# Altium schematic sheet LED-driver 46W 350mA on UCC28810 ver2.SchDoc
size 420 x 297 mm; CompanyName: "LaV"; DrawnBy: Лазарев В.П.; SheetTotal: 1; PageSetup: Record=PageOptions|CenterHorizontal=True|CenterVertical=True|PrintScale=0.65|XCorrection=1.00|YCorrection=1.00|PrintKind=0|BorderSize=5000000|LeftOffset=0|BottomOffset=0|Orientation=2|PaperLength=1000|PaperWidth=1000|Scale=100|PaperSource=260|PrintQuality=600|MediaType=1|DitherType=10|PaperKind=Letter|PrintScaleMode=1
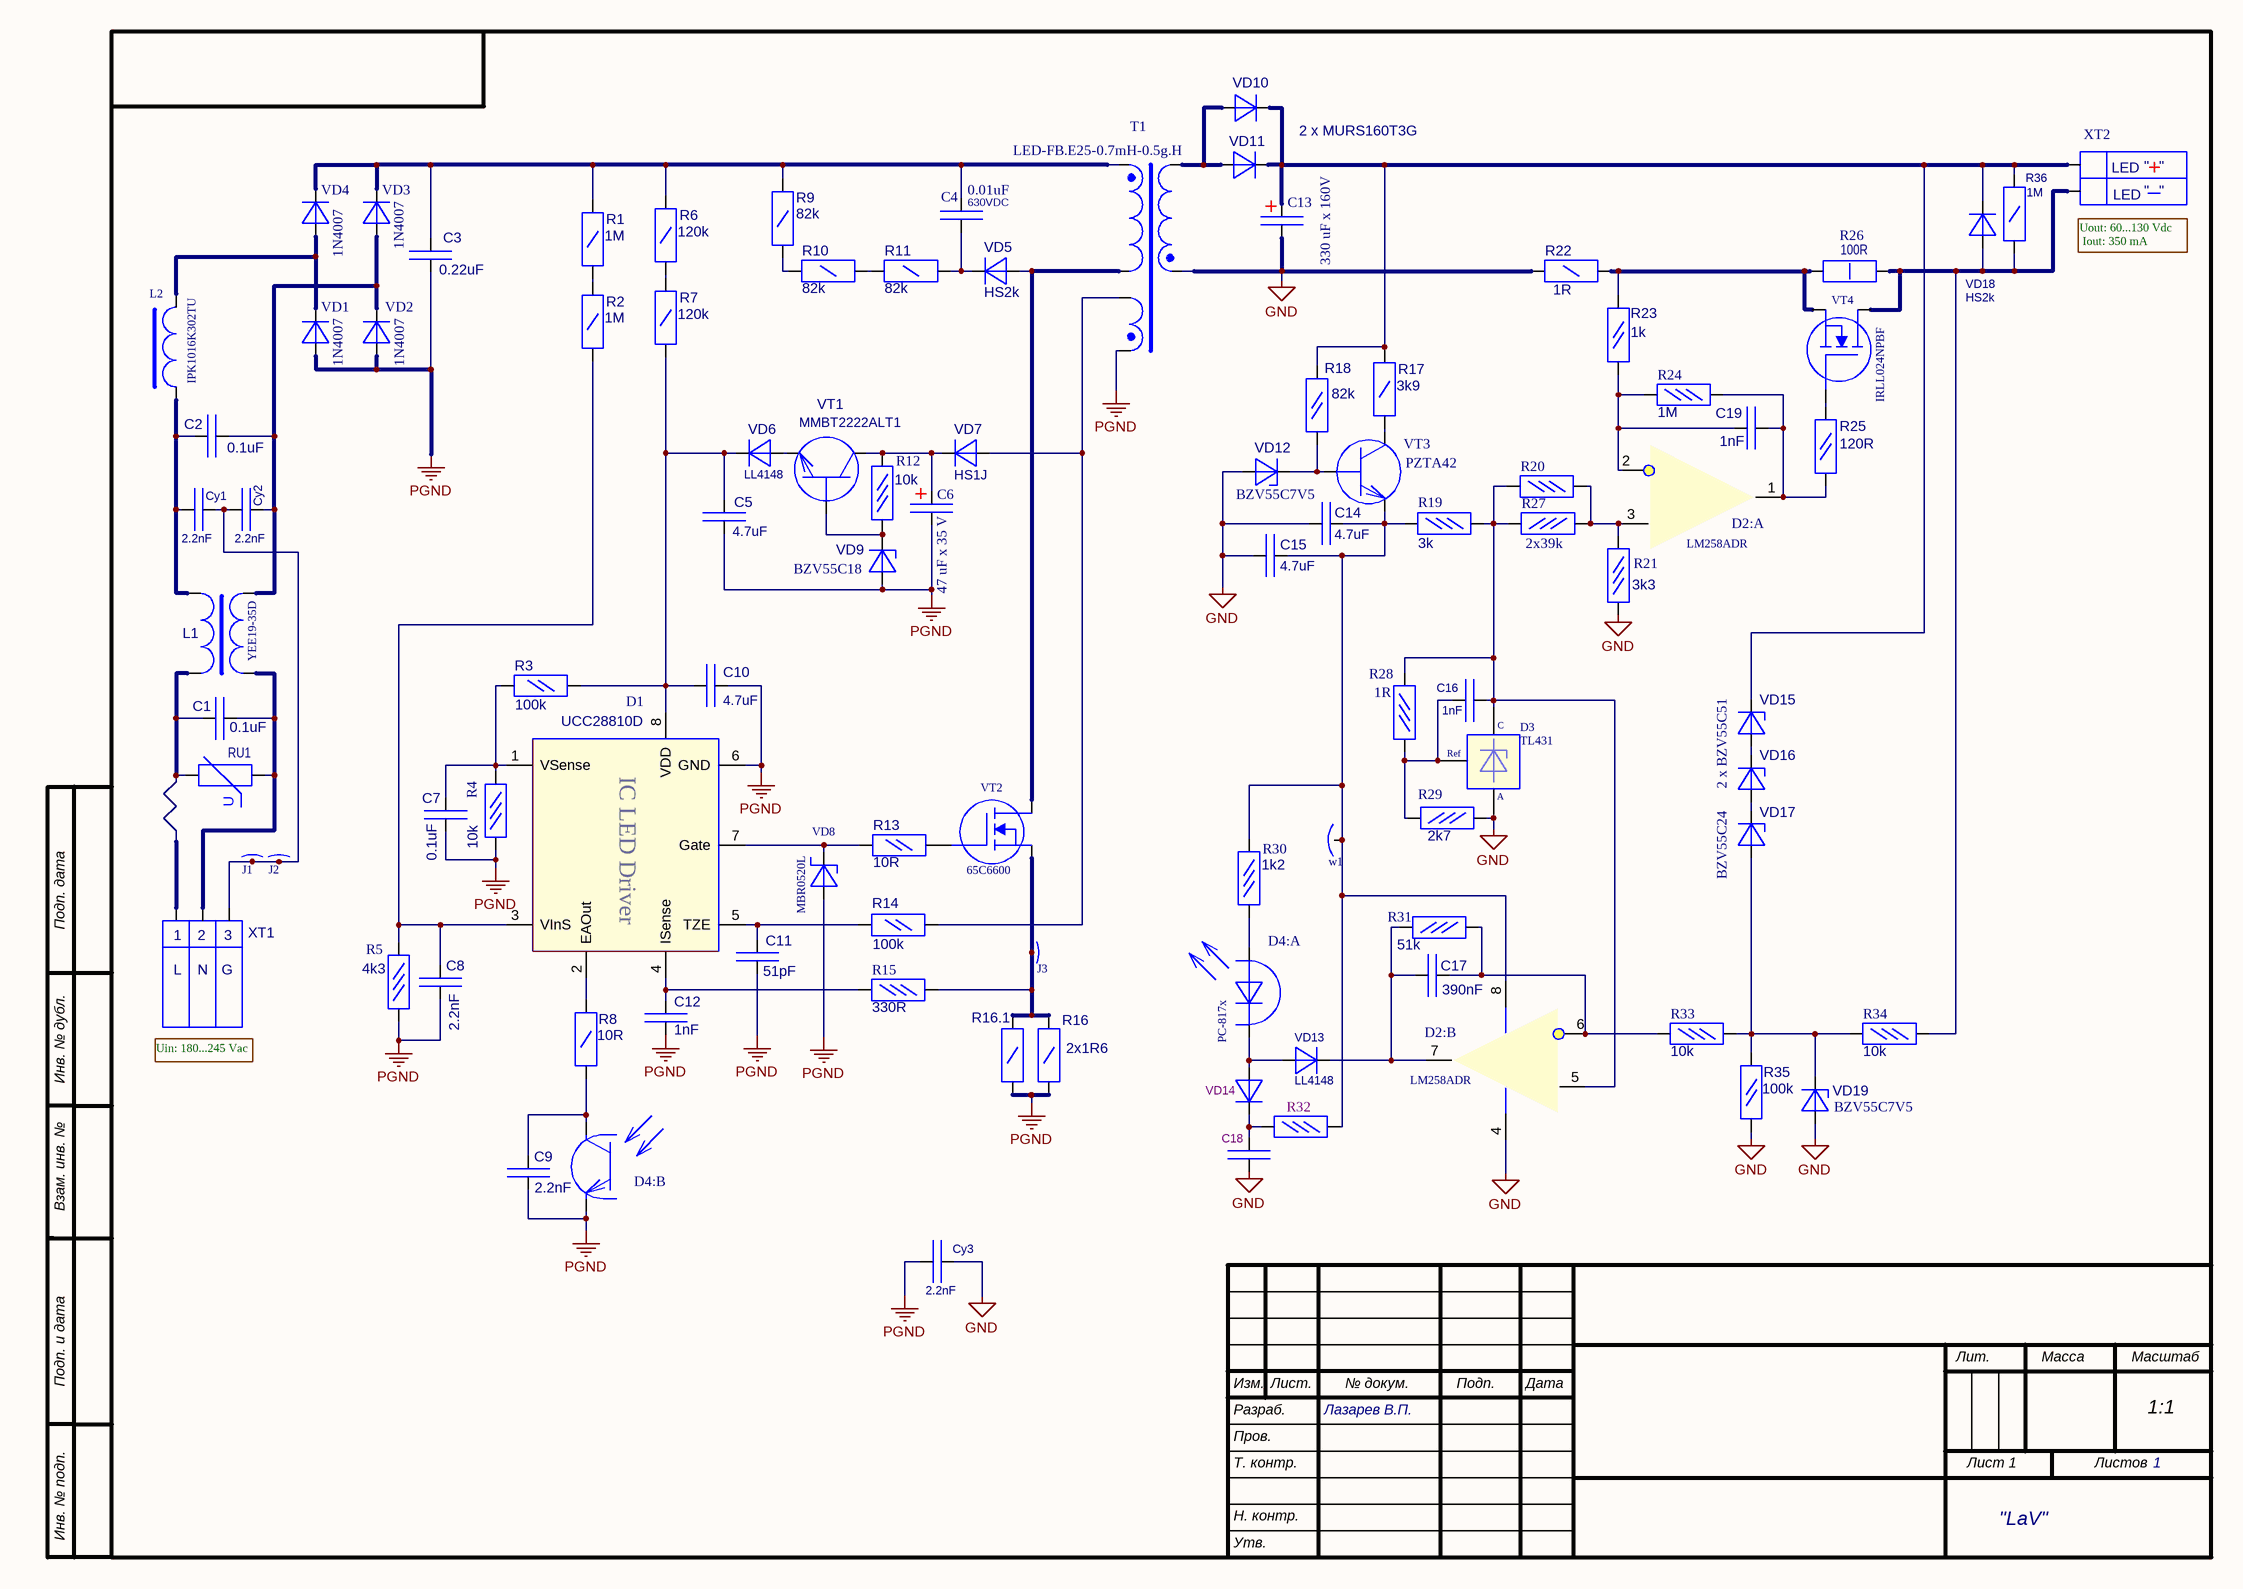
[diagram p0: LED-driver 46W 350mA on UCC28810 ver2.SchDoc]

## Parts
C1  value 0.1uF  [CAPR9.0x18.0-15.0]  (hidden comment: Cap_MKP)
C2  value 0.1uF  [CAPR9.0x18.0-15.0]  (hidden comment: Cap_MKP)
C3  value 0.22uF  [CAPR7.0x18.0-15.0(Polyprop)]  (hidden comment: Cap_MKP)
C4  value 0.01uF  Voltage: 630VDC  [CAPC1812]  (hidden comment: Comment)
C5  value 4.7uF  [CAPC2012 (0805)]  (hidden comment: Cap_SMD)
C6  value 47 uF x 35 V  [CAPR E 6.5x12, pitch 2.5]  (hidden comment: Comment)
C7  value 0.1uF  [1608[0603]]  (hidden comment: Cap_SMD)
C8  value 2.2nF  [1608[0603]]  (hidden comment: Cap_SMD)
C9  value 2.2nF  [1608[0603]]  (hidden comment: Cap_SMD)
C10  value 4.7uF  [CAPC2012 (0805)]  (hidden comment: Cap_SMD)
C11  value 51pF  [1608[0603]]  (hidden comment: Cap_SMD)
C12  value 1nF  [CAPC2012 (0805)]  (hidden comment: Cap_SMD)
C13  value 330 uF x 160V  [CAPR E 10x12.5 pitch 5 - hor]  (hidden comment: Cap Pol)
C14  value 4.7uF  [CAPC2012 (0805)]  (hidden comment: Cap_SMD)
C15  value 4.7uF  [CAPC2012 (0805)]  (hidden comment: Cap_SMD)
C16  value 1nF  [1608[0603]]  (hidden comment: Cap_SMD)
C17  value 390nF  [1608[0603]]  (hidden comment: Cap_SMD)
C18  Cap_SMD  [CAPC2012 (0805)]  (value not drawn)
C19  value 1nF  [1608[0603]]  (hidden comment: Cap_SMD)
Cy1  value 2.2nF  [CAPR Y - 7.5]  (hidden comment: Cap (Y))
Cy2  value 2.2nF  [CAPR Y - 7.5]  (hidden comment: Cap (Y))
Cy3  value 2.2nF  [CAPR Y - 7.5]  (hidden comment: Cap (Y))
D1  UCC28810D  [SO8_M]
D2:  LM258ADR  [SO8_M]  (parts A,B of 2)
D3  TL431  [SOT-23_3D]
D4:  value PC-817x  [PC-817xx]  (hidden comment: Optocoupler)  (parts A,B of 2)
J1  Jumper_1  [AXIAL- Jumper_9.5mm]  (value not drawn)  (net tie)
J2  Jumper_1  [AXIAL- Jumper_9.5mm]  (value not drawn)  (net tie)
J3  Jumper_1  [AXIAL- Jumper_15.0mm]  (value not drawn)  (net tie)
L1  value YEE19-35D  [YEE19-353D]  (hidden comment: Trans EMI)
L2  PartNumber: IPK1016K302TU  [Choke Barbell]  (hidden comment: 3 mH)
R1  value 1M  [RESC3216(1206)N]  (hidden comment: Res 1/4W)
R2  value 1M  [RESC3216(1206)N]  (hidden comment: Res 1/4W)
R3  value 100k  [RESC2012(0805)]  (hidden comment: Res 1/8W)
R4  value 10k  [RESC1608(0603)]  (hidden comment: Res 1/16W)
R5  value 4k3  [RESC1608(0603)]  (hidden comment: Res 1/16W)
R6  value 120k  [RESC3216(1206)N]  (hidden comment: Res 1/4W)
R7  value 120k  [RESC3216(1206)N]  (hidden comment: Res 1/4W)
R8  value 10R  [RESC3216(1206)N]  (hidden comment: Res 1/4W)
R9  value 82k  [RESC3216(1206)N]  (hidden comment: Res 1/4W)
R10  value 82k  [RESC3216(1206)N]  (hidden comment: Res 1/4W)
R11  value 82k  [RESC3216(1206)N]  (hidden comment: Res 1/4W)
R12  value 10k  [RESC1608(0603)]  (hidden comment: Res 1/16W)
R13  value 10R  [RESC2012(0805)]  (hidden comment: Res 1/8W)
R14  value 100k  [RESC2012(0805)]  (hidden comment: Res 1/8W)
R15  value 330R  [RESC1608(0603)]  (hidden comment: Res 1/16W)
R16  value 2x1R6  [RESC3216(1206)N]  (hidden comment: Res 1/4W)
R16.1  Res 1/4W  [RESC3216(1206)N]  (value not drawn)
R17  value 3k9  [RESC3216(1206)N]  (hidden comment: Res 1/4W)
R18  value 82k  [RESC2012(0805)]  (hidden comment: Res 1/8W)
R19  value 3k  [RESC1608(0603)]  (hidden comment: Res 1/16W)
R20  Res 1/16W  [RESC1608(0603)]  (value not drawn)
R21  value 3k3  [RESC1608(0603)]  (hidden comment: Res 1/16W)
R22  value 1R  [RESC3216(1206)N]  (hidden comment: Res 1/4W)
R23  value 1k  [RESC2012(0805)]  (hidden comment: Res 1/8W)
R24  value 1M  [RESC1608(0603)]  (hidden comment: Res 1/16W)
R25  value 120R  [RESC2012(0805)]  (hidden comment: Res 1/8W)
R26  value 100R  [RESC6332]  (hidden comment: Res 1W)
R27  value 2x39k  [RESC1608(0603)]  (hidden comment: Res 1/16W)
R28  value 1R  [RESC1608(0603)]  (hidden comment: Res 1/16W)
R29  value 2k7  [RESC1608(0603)]  (hidden comment: Res 1/16W)
R30  value 1k2  [RESC1608(0603)]  (hidden comment: Res 1/16W)
R31  value 51k  [RESC1608(0603)]  (hidden comment: Res 1/16W)
R32  Res 1/16W  [RESC1608(0603)]  (value not drawn)
R33  value 10k  [RESC1608(0603)]  (hidden comment: Res 1/16W)
R34  value 10k  [RESC1608(0603)]  (hidden comment: Res 1/16W)
R35  value 100k  [RESC2012(0805)]  (hidden comment: Res 1/8W)
R36  value 1M  [RESC3216(1206)N]  (hidden comment: Res 1/4W)
RU1  Varistor  [VAristor 7.5-11x5]  (value not drawn)
T1  LED-FB.E25-0.7mH-0.5g.H  [FB-E25/50W]
VD1  value 1N4007  [CD4532-1812 (mod)]
VD2  value 1N4007  [CD4532-1812 (mod)]
VD3  value 1N4007  [CD4532-1812 (mod)]  (hidden comment: Diode HS1x)
VD4  value 1N4007  [CD4532-1812 (mod)]
VD5  value HS2k  [CD4532-1812 (mod)]  (hidden comment: Diode1)
VD6  value LL4148  [MELF-D3516-1406]  (hidden comment: Diode LL4148)
VD7  value HS1J  [CD4532-1812 (mod)]  (hidden comment: Diode1)
VD8  value MBR0520L  [CD3216-1206]  (hidden comment: Diode Schottky)
VD9  value BZV55C18  [MELF-D3516-1406]  (hidden comment: Diode Zener)
VD10  value 2 x MURS160T3G  [CD4532-1812 (mod)]  (hidden comment: Diode1)
VD11  Diode1  [CD4532-1812 (mod)]  (value not drawn)
VD12  value BZV55C7V5  [MELF-D3516-1406]  (hidden comment: Diode Zener)
VD13  value LL4148  [MELF-D3516-1406]  (hidden comment: Diode LL4148)
VD14  Diode LL4148  [MELF-D3516-1406]  (value not drawn)
VD15  value 2 x BZV55C51  [MELF-D3516-1406]  (hidden comment: Diode Zener)
VD16  Diode Zener  [MELF-D3516-1406]  (value not drawn)
VD17  value BZV55C24  [MELF-D3516-1406]  (hidden comment: Diode Zener)
VD18  value HS2k  [CD4532-1812 (mod)]  (hidden comment: Diode1)
VD19  value BZV55C7V5  [MELF-D3516-1406]  (hidden comment: Diode Zener)
VT1  value MMBT2222ALT1  [SOT-23_3D]  (hidden comment: BC847)
VT2  Value2: 65C6600  [TO-220-AB (MOSFET)]  (hidden comment: MOSFET-N1)
VT3  PZTA42  [SOT223_M]
VT4  value IRLL024NPBF  [SOT223_M]  (hidden comment: MOSFET-N5(G))
w1  Jumper_1  [Jumper-Res 1206]  (value not drawn)  (net tie)
XT1  Connect x3  [ZIP-Ballast3]  (value not drawn)
XT2  Connect x2  [ZIP-Ballast2]  (value not drawn)

## Nets
GND: C13.2 C14.2 C15.2 C18.2 Cy3.2 D2:.4(V-) D3.3(Anode) R21.1 R22.2 R29.1 R35.1 T1.6(Sec-) VD12.1 VD19.1
PGND: C3.1 C5.1 C6.2 C7.1 C8.1 C9.1 C10.2 C11.2 C12.2 Cy3.1 D1.6(GND) D4:.3(Emitter) R4.2 R5.2 R16.1 R16.1.1 T1.5(TZE-) VD1.1 VD2.1 VD8.1(Anode) VD9.1
NetC1_1: C1.1 L1.4(Pri+) RU1.1 XT1.2
NetC1_2: C1.2 L1.1(Sec+) RU1.2 XT1.1
NetC2_1: C2.1 Cy2.2 L1.3(Pri-) VD2.2 VD3.1
NetC2_2: C2.2 Cy1.1 L1.2(Sec-) L2.1(Pri+)
NetC3_2: C3.2 C4.1 R1.2 R6.2 R9.1 T1.1(Pri-) VD3.2 VD4.2
NetC4_2: C4.2 R11.1 VD5.2
NetC5_2: C5.2 C10.1 D1.8(VDD) R3.2 R7.1 VD6.2
NetC6_1: C6.1 R12.1 VD7.2 VT1.3(C)
NetC7_2: C7.2 D1.1(VSense) R3.1 R4.1
NetC8_2: C8.2 D1.3(VInS) R2.1 R5.1
NetC9_2: C9.2 D4:.4(Collector) R8.2
NetC11_1: C11.1 D1.5(TZE) R14.1
NetC12_1: C12.1 D1.4(ISense) R15.2
NetC13_1: C13.1 R17.2 R18.1 R36.1 VD10.2 VD11.2 VD15.2 VD18.2 XT2.2
NetC14_1: C14.1 C15.1 D2:.8(V+) R19.2 R30.1 R32.1 VT3.3(E) w1.1(W*)
NetC16_1: C16.1 D3.2(Ref) R28.2 R29.2
NetC16_2: C16.2 D2:.5(IN+) D3.1(Cathode) R19.1 R20.2 R27.1 R28.1
NetC17_1: C17.1 D2:.6(IN-) R31.1 R33.1
NetC17_2: C17.2 D2:.7(OUT) R31.2 VD13.2
NetC18_1: C18.1 R32.2 VD14.2
NetC19_1: C19.1 D2:.1(OUT) R24.1 R25.2
NetC19_2: C19.2 D2:.2(IN-) R23.1 R24.2
NetCy1_2: Cy1.2 Cy2.1 J1.1(W*) J2.1(W*) XT1.3
NetD1_2: D1.2(EAOut) R8.1
NetD1_7: D1.7(Gate) R13.2 VD8.2(Catode)
NetD2:_3: D2:.3(IN+) R20.1 R21.2 R27.2
NetD4:_1: D4:.1(Led_Anode) R30.2
NetD4:_2: D4:.2(Led_Cathode) VD13.1 VD14.1
NetJ3_1: J3.1(W*) R15.1 R16.2 R16.1.2 VT2.3(S)
NetL2_2: L2.2(Pri-) VD1.2 VD4.1
NetR1_1: R1.1 R2.2
NetR6_1: R6.1 R7.2
NetR9_2: R9.2 R10.2
NetR10_1: R10.1 R11.2
NetR12_2: R12.2 VD9.2 VT1.1(B)
NetR13_1: R13.1 VT2.1(G)
NetR14_2: R14.2 T1.4(TZE+) VD7.1
NetR17_1: R17.1 VT3.2(C)
NetR18_2: R18.2 VD12.2 VT3.1(B)
NetR22_1: R22.1 R23.2 R26.1 VT4.3(S)
NetR25_1: R25.1 VT4.1(G)
NetR26_2: R26.2 R34.1 R36.2 VD18.1 VT4.2(D) XT2.1
NetR33_2: R33.2 R34.2 R35.2 VD17.1 VD19.2
NetT1_3: T1.3(Pri+) VD5.1 VT2.2(D)
NetT1_10: T1.10(Sec+) VD10.1 VD11.1
NetVD6_1: VD6.1 VT1.2(E)
NetVD15_1: VD15.1 VD16.2
NetVD16_1: VD16.1 VD17.2

## Notes on the sheet
- (near XT2) LED
- "
- +
- _
- (near XT2) Uout: 60...130 Vdc
  Iout: 350 mA
- (near XT1) 1
- (near XT1) L
- (near XT1) 2
- (near XT1) N
- (near XT1) G
- (near XT1) 3
- Uin: 180...245 Vac
- Подп. дата
- Инв. № дубл.
- Взам. инв. №
- Подп. и дата
- Изм.
- Лист.
- № докум.
- Подп.
- Дата
- Лит.
- Масса
- Масштаб
- Разраб.
- Пров.
- Т. контр.
- Лист 1
- Листов
- 1:1
- Инв. № подп.
- Н. контр.
- Утв.
- (in symbol TL431) C; A
- (in symbol Varistor) U

## Library data of the parts
C1 = Cap_MKP: Cap DIP (MKP); Voltage: 275VAC/400VDC; Function: EMI Filter; Tolerance: 20%; Dielectric: Polypropylene (MKP) - X2 class; PackageDescription: Radial, Thru-Hole Body 9.0x18.0x18.0mm(WxLxH), Pin Spacing 15.0mm; Supplier 1: *; Supplier Part Number 1: *
C2 = Cap_MKP: Cap DIP (MKP); Voltage: 275VAC/400VDV; Function: EMI Filter; Tolerance: 20%; Dielectric: Polypropylene (MKP) - X2 class; PackageDescription: Radial, Thru-Hole Body 9.0x18.0x18.0mm(WxLxH), Pin Spacing 15.0mm; Supplier 1: *; Supplier Part Number 1: *
C3 = Cap_MKP: Cap DIP (MKP); Voltage: 400VAC/630VDC; Function: EMI Filter; Tolerance: 20%; Dielectric: Polypropylene (MKP) - X2 class; PackageDescription: Radial, Thru-Hole Body 9.0x18.0x18.0mm(WxLxH), Pin Spacing 15.0mm; Supplier 1: *; Supplier Part Number 1: *
C4 = Cap1: Capacitor GOST; Tolerance: 10 %; Dielectrik: Ceramic; PackageDescription: SMD Capacitor; Package Reference: CC2220; Function: *; Part Number: *; Supplier: *; Supplier Part Number: *
C5 C8 C10 C14-C16 C19 = Cap_SMD: Ceramic; Voltage: 50V; Tolerance %: 10%; Dielectric: X7R; Function: *; Supplier: *; Supplier Part Number: *
  C5 C10 C14-C16 C19: PackageDescription: SMD CC0805
  C8: PackageDescription: SMD CC0603
C6 = Cap Pol: Cap Pol GOST; Tolerance: 10%; Function: Electrolytic Aluminum Capasitor; Supplier: *; PackageDescription: Radial, Thru-Hole Body 13.0x25.0 (DxH)mm, Pin Spacing 5.0mm
C7 C9 C11 C12 = Cap_SMD: Ceramic; Voltage: 25V; Tolerance %: 10%; Dielectric: X7R; Function: *; Supplier: *; Supplier Part Number: *
  C7 C11 C12: PackageDescription: SMD CC0603
  C9: PackageDescription: SMD CC0805
C13 = Cap Pol: Cap Pol GOST; Tolerance: 10%; Function: 0; Supplier: *; PackageDescription: Radial, Thru-Hole Body 22.0x36.0 (DxH)mm, Pin Spacing 12.5mm
C17 = Cap_SMD: Ceramic; Voltage: 50V; Tolerance %: 10%; Dielectric: X7R; Value2: 220-470nF; PackageDescription: SMD CC0805; Function: *; Supplier: *; Supplier Part Number: *
C18 = Cap_SMD: Ceramic; Voltage: 50V; Value: 4.7uF; Tolerance %: 10%; Dielectric: X7R; PackageDescription: SMD CC0805; Function: *; Supplier: *; Supplier Part Number: *
Cy1-Cy3 = Cap (Y): Disc Ceramic; Voltage: 275VAC/400VDV; Function: Y-capacitor; Tolerance %: 20%; Dielectric: Ceramic Y1-class; PackageDescription: Radial, Disc Body , Pin Spacing 7.5mm; Supplier 1: *; Supplier Part Number 1: *
D1 = UCC28810D: IC LED Driver; Functuion: LED-Driver Controller; PackageReference: SOIC8; Supplier: Texac Instrument; Value: UCC28810D
D2: = LM258ADR: Dual Operational Amplifier; Function: Low Power Dual OpAm; PackageDescription: SOIC-8 (8-Pin Small Outline Integrated Circuit 1.27 mm ); Value: LM258ADR
D3 = TL431: Prog Pre Ref_GOST; Function: Programmable Precision Reference; PackageReference: *; PackageDescription: SOT 23-3; Part Number: *; Value: TL431
D4: = Optocoupler: Phototransistor Optocoupler; Function: OptoIsolator/OptoCouple; PackageReference: SMD 4 pin
J1-J3 = Jumper_1: Jumper Wire; PackageDescription: Axial Jumper, Thru-Hole; 2 Leads
L1 = Trans EMI: Trans EMI (GOST); Function: EMI Filter; PackageDescription: *
L2 = Choke Barbell: Barbell 10 mm(d); Function: Choke EMI; PackageDescription: Barbell 11mm D; Value: 3 mH
R1 R2 R6 R7 = Res 1/4W: Resistor GOST; Tolerance: 10%; Voltage: 400Vdc; PackageDescription: Chip Resistor, Body 3.2x1.6mm,; PackageReference: *; Function: *; Part Number: *
R3 R13 R14 R18 R23 R25 R35 = Res 1/8W: Resistor GOST; Tolerance: 1%; PackageDescription: Chip Resistor, Body 2.0x1.3mm,; PackageReference: *; Part Number: *
R4 R5 R15 = Res 1/16W: CR0603 GOST; Tolerance: 1%; Voltage: 25Vdc; PackageDescription: Chip 0603; PackageReference: RC0603; Part Number: *
R8 R16 R36 = Res 1/4W: Resistor GOST; Tolerance: 10%; PackageDescription: Chip Resistor, Body 3.2x1.6mm.; PackageReference: *; Function: *; Part Number: *
R9-R11 = Res 1/4W: Resistor GOST; Tolerance: 5%; PackageDescription: Chip Resistor, Body 3.2x1.6mm,; PackageReference: *; Function: *; Part Number: *
R12 R19 R21 R24 R28-R31 R33 R34 = Res 1/16W: CR0603 GOST; Tolerance: 1%; PackageDescription: Chip 0603; PackageReference: RC0603; Part Number: *
R16.1 = Res 1/4W: Resistor GOST; Value: 2x1R6; Tolerance: 10%; PackageDescription: Chip Resistor, Body 3.2x1.6mm.; PackageReference: *; Function: *; Part Number: *
R17 = Res 1/4W: Resistor GOST; Tolerance: 10%; Voltage: 200Vdc; PackageDescription: Chip Resistor, Body 3.2x1.6mm,; PackageReference: *; Function: *; Part Number: *
R20 = Res 1/16W: CR0603 GOST; Value: 19k42; Tolerance: 0.5%; PackageDescription: Chip 0603; PackageReference: RC0603; Part Number: *
R22 = Res 1/4W: Resistor GOST; Tolerance: 1%; PackageDescription: Chip Resistor, Body 3.2x1.6mm.; PackageReference: *; Function: *; Part Number: *
R26 = Res 1W: Resistor GOST; PackageDescription: CR2512; PackageReference: *; Part Number: *
R27 = Res 1/16W: CR0603 GOST; Tolerance: 0.5%; Value2: 19k42; PackageDescription: Chip 0603; PackageReference: RC0603; Part Number: *
R32 = Res 1/16W: CR0603 GOST; Value: 10k; Tolerance: 1%; PackageDescription: Chip 0603; PackageReference: RC0603; Part Number: *
RU1 = Varistor: Varistor GOST; Part Number: ERZ-V05D471; Function: Transient Suppressor; Value: *; PackageReference: Varistor, Thru-Hole, Disc; Body 11 x 5 mm (LxW max) Pin Spacing 7.5 mm (typ)
T1 = Trans FB-E25: FlyBack E25/50W; Function: FlyBack Transformer; PackageDescription: E25/13/7; Value: LED-FB.E25-0.7mH-0.5g.H
VD1-VD4 = Diode1: Diode GOST; Function: Rectifier diode; Part Number: *; PackageDescription: Chip Diode; Body 4.5 x 3.2 mm (LxW typ); PackageReference: *
VD5 VD7 VD10 VD18 = Diode1: Diode GOST; Part Number: *; PackageDescription: Chip Diode; Body 4.5 x 3.2 mm (LxW typ); PackageReference: *; Function: *
VD6 VD13 VD14 = Diode LL4148: Diode LL4148 (GOST); Package Description: Metal Electrode Face (MELF) Diode; Body 3.5 x 1.7 mm (LxDia); Part Number: *; Function: *
  VD14: Value: LL4148
VD8 = Diode Schottky: Diode Schottky GOST; Function: *; PackageReference: *; PackageDescription: *; Part Number: *
VD9 = Diode Zener: Diode Zener GOST; Function: Zener Diode 18V; PackageReference: *; PackageDescription: Metal Electrode Face (MELF) Diode; Body 3.5 x 1.7 mm (LxDia); Part Number: *
VD11 = Diode1: Diode GOST; Value: MURS160T3G; Part Number: *; PackageDescription: Chip Diode; Body 4.5 x 3.2 mm (LxW typ); PackageReference: *; Function: *
VD12 VD19 = Diode Zener: Diode Zener GOST; Function: Zener Diode 10V; PackageReference: *; PackageDescription: Metal Electrode Face (MELF) Diode; Body 3.5 x 1.7 mm (LxDia); Part Number: *
VD15 VD17 = Diode Zener: Diode Zener GOST; Function: Zener Diode 51V; PackageReference: *; PackageDescription: Metal Electrode Face (MELF) Diode; Body 3.5 x 1.7 mm (LxDia); Part Number: *
VD16 = Diode Zener: Diode Zener GOST; Function: Zener Diode 51V; Value: 3 x BZV55C51; PackageReference: *; PackageDescription: Metal Electrode Face (MELF) Diode; Body 3.5 x 1.7 mm (LxDia); Part Number: *
VT1 = BC847: NPN_SOT23; Functioun: Bipolar NPN; Vceo=40V; Ic=600mA; PackageDescription: SOT-23; PackageReference: *; Part Number: *
VT2 = MOSFET-N1: N-Channel MOSFET GOST; Functioun: MOSFET N-channel 650V, 5A, 0.6Ohm; PackageDescription: *; PackageReference: *; Part Number: *
VT3 = PZTA42: NPN_SOT23; Functioun: Bipolar NPN; Vceo=300V; Ic=500mA; PackageDescription: SMD; PackageReference: SOT-233-3; Part Number: *; Value: PZTA42
VT4 = MOSFET-N5(G): N-Channel MOSFET, SOT-223; Functioun: MOSFET N-channel , 55В, 3.1А, 65mOm; PackageDescription: SOT-223; PackageReference: *; Part Number: *
w1 = Jumper_1: Jumper Wire; Function: Chip Jumper; PackageDescription: Chip Body 1206 (3.2x1.6 mm.)
XT1 = Connect x3: Connect x3 GOST; Function: Input connector
XT2 = Connect x2: Connect x2 GOST